# Altium schematic sheet CLKB_SFP_wrapper.SchDoc
size A4
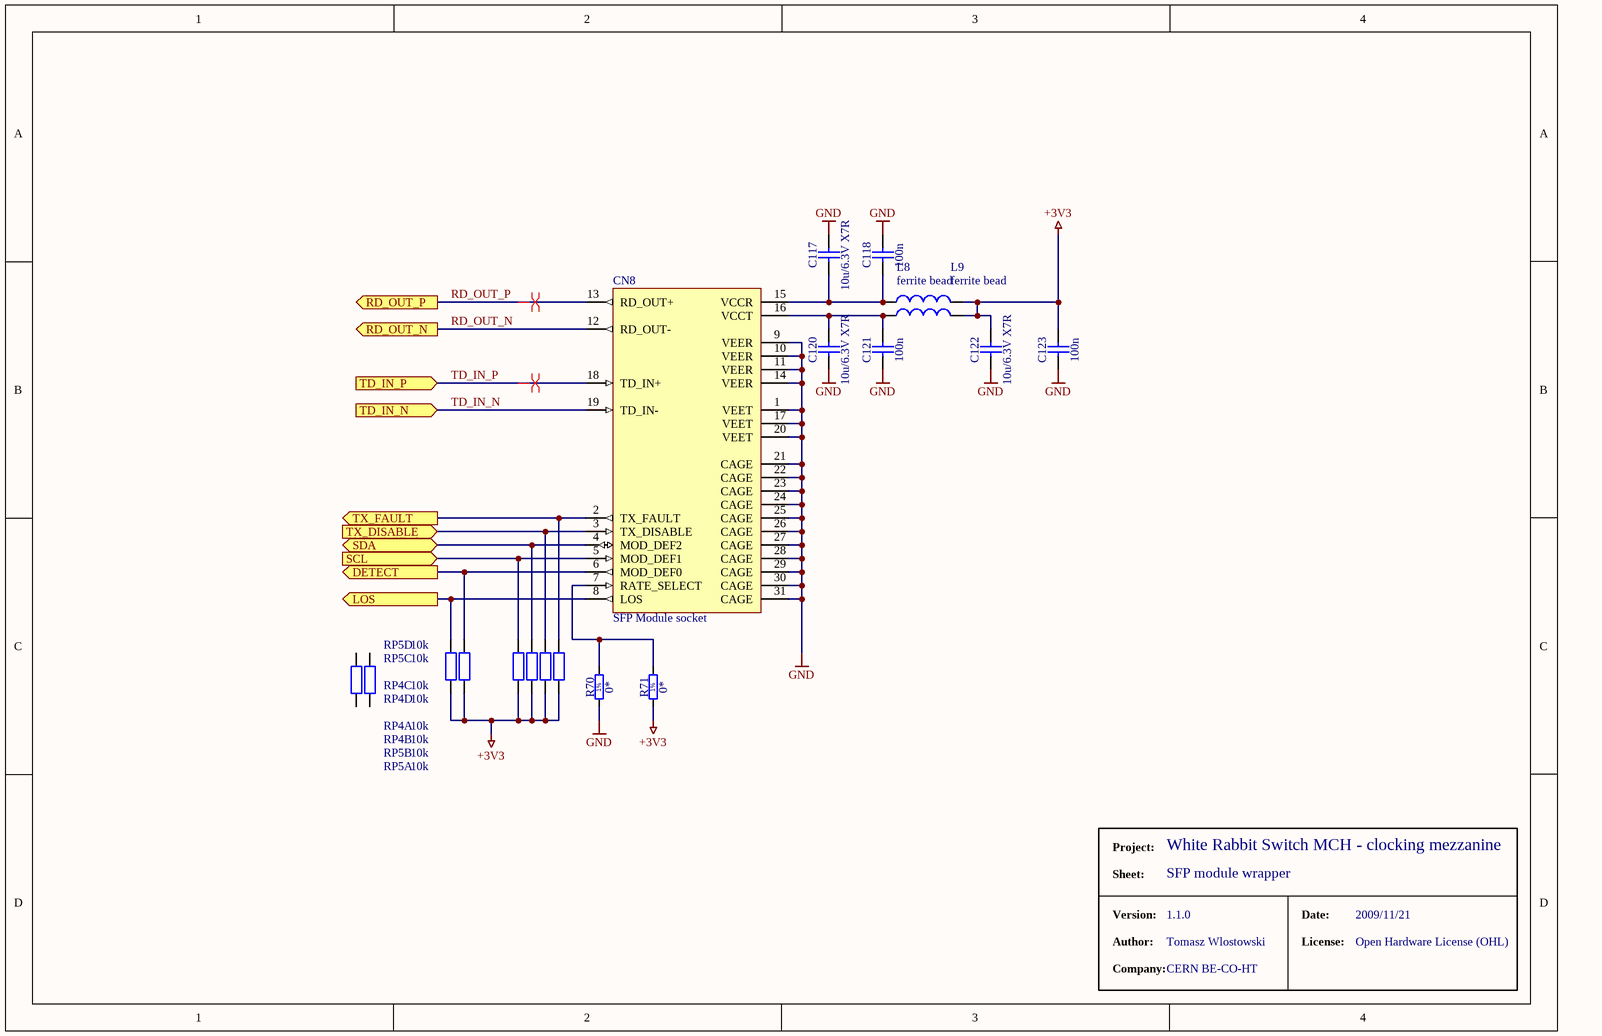
[diagram p0: CLKB_SFP_wrapper.SchDoc]

## Parts
C117  10u/6.3V X7R  [CAPC3216X140N]
C118  100n  [CAPC1608X87N]
C120  10u/6.3V X7R  [CAPC3216X140N]
C121  100n  [CAPC1608X87N]
C122  10u/6.3V X7R  [CAPC3216X140N]
C123  100n  [CAPC1608X87N]
CN8  SFP Module socket  [SFP_SINGLE_PORT]
L8  value ferrite bead  [INDC2012-0805]  (hidden comment: Inductor)
L9  value ferrite bead  [INDC2012-0805]  (hidden comment: Inductor)
R70  0*  [RESC1608X55N]
R71  0*  [RESC1608X55N]
RP4  value 10k  [YC124]  (hidden comment: 10k 0804)  (parts A,B,C,D of 4)
RP5  value 10k  [YC124]  (hidden comment: 10k 0804)  (parts A,B,C,D of 4)

## Ports
DETECT (out), LOS (out), RD_OUT_N (out), RD_OUT_P (out), SCL (in), SDA (bidir), TD_IN_N (in), TD_IN_P (in), TX_DISABLE (in), TX_FAULT (out)

## Nets
+3V3: C122.2 C123.2 L8.2 L9.2 R71.1 RP4.1(A) RP4.2(A) RP4.3(A) RP4.4(A) RP5.1(A) RP5.2(A)
GND: C117.2 C118.2 C120.1 C121.1 C122.1 C123.1 CN8.1(VEET) CN8.9(VEER) CN8.10(VEER) CN8.11(VEER) CN8.14(VEER) CN8.17(VEET) CN8.20(VEET) CN8.21(CAGE) CN8.22(CAGE) CN8.23(CAGE) CN8.24(CAGE) CN8.25(CAGE) CN8.26(CAGE) CN8.27(CAGE) CN8.28(CAGE) CN8.29(CAGE) CN8.30(CAGE) CN8.31(CAGE) R70.1
DETECT: CN8.6(MOD_DEF0) RP4.6(B) ; port DETECT
LOS: CN8.8(LOS) RP4.5(B) ; port LOS
RD_OUT_N: CN8.12(RD_OUT-) ; port RD_OUT_N
RD_OUT_P: CN8.13(RD_OUT+) ; port RD_OUT_P
SCL: CN8.5(MOD_DEF1) RP4.7(B) ; port SCL
SDA: CN8.4(MOD_DEF2) RP4.8(B) ; port SDA
TD_IN_N: CN8.19(TD_IN-) ; port TD_IN_N
TD_IN_P: CN8.18(TD_IN+) ; port TD_IN_P
TX_DISABLE: CN8.3(TX_DISABLE) RP5.7(B) ; port TX_DISABLE
TX_FAULT: CN8.2(TX_FAULT) RP5.8(B) ; port TX_FAULT
NetC117_1: C117.1 C118.1 CN8.15(VCCR) L9.1
NetC120_2: C120.2 C121.2 CN8.16(VCCT) L8.1
NetCN8_7: CN8.7(RATE_SELECT) R70.2 R71.2

Not connected (* = marked no-connect by the designer): RP5 3(A) 4(A) 5(B) 6(B)

## Layout directives
differential pair: RD_OUT_P, TD_IN_P

## Notes on the sheet
- Project:
- White Rabbit Switch MCH - clocking mezzanine
- Sheet:
- Version:
- SFP module wrapper
- 1.1.0
- Date:
- 2009/11/21
- Author:
- Company:
- Tomasz Wlostowski
- CERN BE-CO-HT
- License:
- Open Hardware License (OHL)
- (in symbol R0603_0R_JUMPER) 1%

## Library data of the parts
C117 C120 C122 = CC1206_10UF_10V_10%_X7R: Non-polarised capacitor; Part Description: SMD Multilayer Chip Ceramic Capacitor; Manufacturer: GENERIC; Manufacturer1 Part Number: C1206C106K8RAC; Manufacturer1 Datasheet: \\cern.ch\dfs\Applications\Altium\Datasheets\CC1206_X7R_KEMET.pdf; Value: 10uF; Voltage: 10V; Tolerance: ±10%; Table: Capacitors SMD; Part Number: CC1206_10UF_10V_10%_X7R; Component Kind: Standard; Component Type: Standard; Designator: Capacitor - non polarized; Library Reference: Capacitor - non polarized; Pin Count: 2; Status: Preferred; TC: X7R; Manufacturer Part Number: CC1206_10uF_10V_10%_X7R; Case: 1206; Mounted: Yes; Socket: No; SMD: Yes; Manufacturer1 Example: KEMET; Manufacturer1 ComponentHeight: 1.8mm; HelpURL: \\cern.ch\dfs\Applications\Altium\Datasheets\CC1206_X7R_KEMET.pdf; Author: CERN DEM JLC; CreateDate: 12/3/2007; LatestRevisionDate: 12/3/2007
C118 C121 C123 = CC0603_100NF_50V_10%_X7R: Non-polarised capacitor; Part Description: SMD Multilayer Chip Ceramic Capacitor; Manufacturer: GENERIC; Manufacturer1 Part Number: 223858615649; Manufacturer1 Datasheet: \\cern.ch\dfs\Applications\Altium\Datasheets\CC0603_X7R_PHYCOMP.pdf; Value: 100nF; Voltage: 50V; TC: X7R; Tolerance: ±10%; Table: Capacitors SMD; Part Number: CC0603_100NF_50V_10%_X7R; Component Kind: Standard; Component Type: Standard; Designator: Capacitor - non polarized; Library Reference: Capacitor - non polarized; Pin Count: 2; Status: Preferred; Manufacturer Part Number: CC0603_100NF_50V_10%_X7R; Case: 0603; Mounted: Yes; Socket: No; SMD: Yes; Manufacturer1 Example: PHYCOMP; Manufacturer1 ComponentHeight: 0.87mm; HelpURL: \\cern.ch\dfs\Applications\Altium\Datasheets\CC0603_X7R_PHYCOMP.pdf; Author: CERN DEM JLC; CreateDate: 12/3/2007; LatestRevisionDate: 12/3/2007
CN8 = SFP_SOCKET_SINGLE: Socket for SFP module; RefId: Far/1256176
L8 L9 = Inductor: Ferrite bead; Published: 8-Jun-2000; Revision: July-2002: Re-released for DXP Platform.; Publisher: Altium Limited
R70 R71 = R0603_0R_JUMPER: Resistor - 1%; Part Description: 1A (0.05R Max DC Resistance) Zero Ohm Jumper; Manufacturer: GENERIC; Manufacturer1 Part Number: NRC06Z0; Manufacturer1 Datasheet: \\cern.ch\dfs\Applications\Altium\Datasheets\R0603_NIC_NRC.pdf; Value: 0; Table: Resistors SMD; Part Number: R0603_0R_JUMPER; Component Kind: Standard; Component Type: Standard; Designator: Resistor - 1%; Library Reference: Resistor - 1%; Pin Count: 2; Status: Preferred; Manufacturer Part Number: R0603_0R_JUMPER; Case: 0603; Mounted: Yes; Socket: No; SMD: Yes; Manufacturer1 Example: NIC COMPONENT; Manufacturer1 ComponentHeight: 0.55mm; HelpURL: \\cern.ch\dfs\Applications\Altium\Datasheets\R0603_NIC_NRC.pdf; Author: CERN DEM JLC; CreateDate: 12/3/2007; LatestRevisionDate: 3/13/2008
RP4 RP5 = Res_Pack4_10k_YC124: 4-resistor pack; RefId: AVX  CRB2A4 series; Supplier: Farnell